# EAGLE schematic Board (EAGLE 9.5.1)
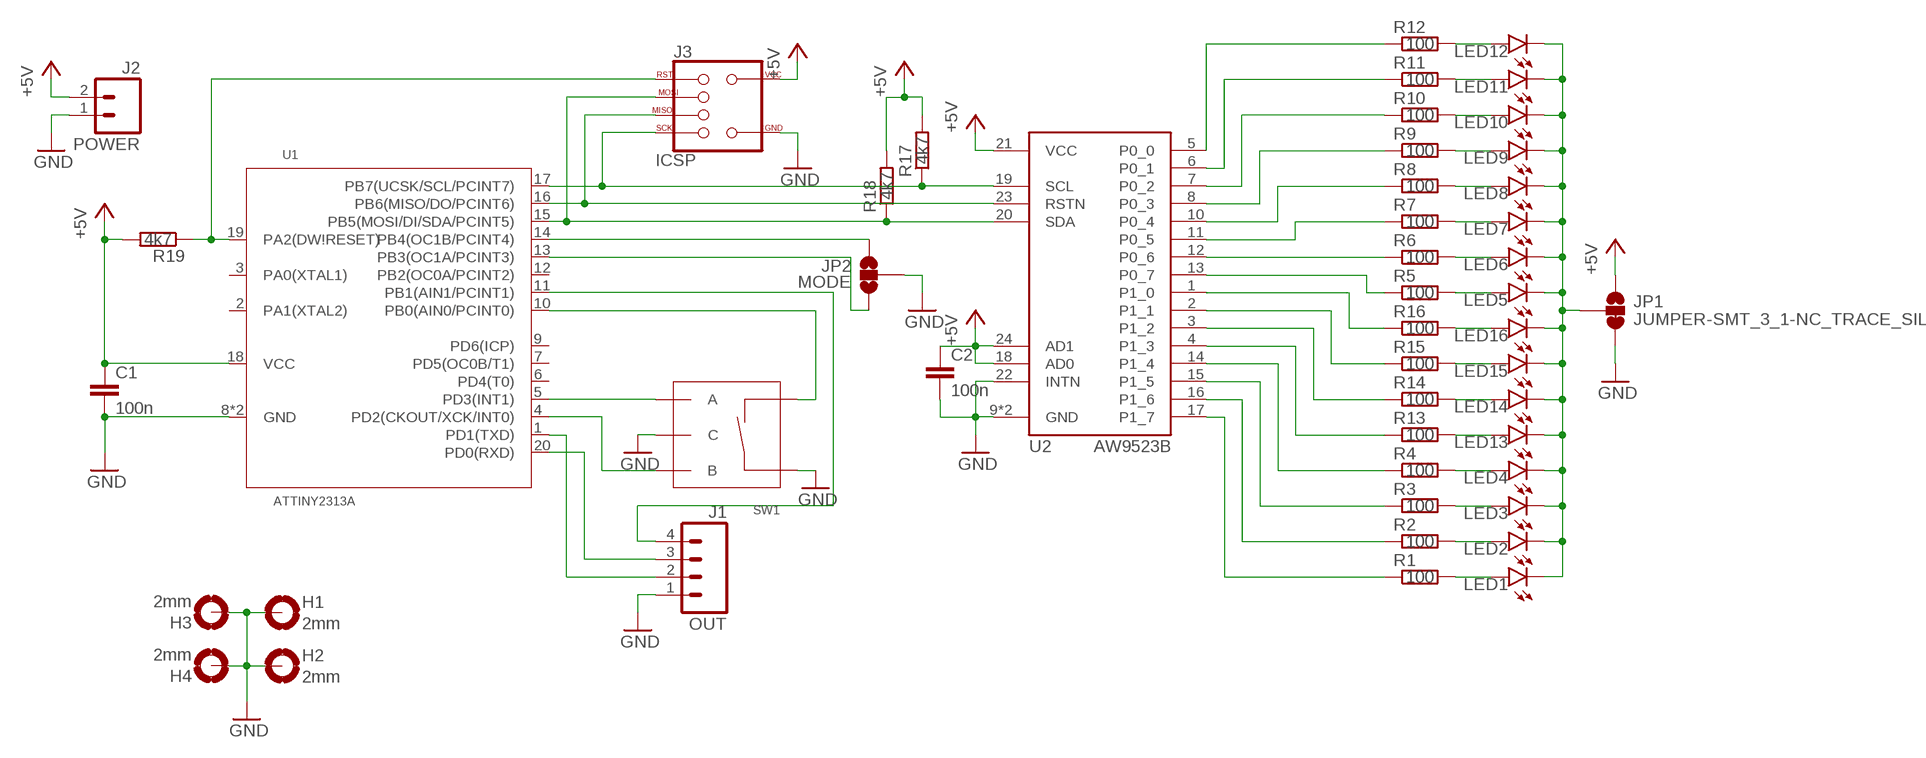
[diagram p0: schematic, sheet 1]

## Parts
C1  100n  C-EUC0402  [C0402]
C2  100n  C-EUC0402  [C0402]
H1  2mm  MOUNT-PAD2MM  [2,0-PAD]
H2  2mm  MOUNT-PAD2MM  [2,0-PAD]
H3  2mm  MOUNT-PAD2MM  [2,0-PAD]
H4  2mm  MOUNT-PAD2MM  [2,0-PAD]
J1  OUT  JST-XH4  [JST-4-PTH-VERT]
J2  POWER  JST-XH2  [JST-2-PTH-VERT]
J3  ICSP  MINI-ISP-LABELS  [MINI-ISP-LABELS]
JP1  JUMPER-SMT_3_1-NC_TRACE_SILK  [SMT-JUMPER_3_1-NC_TRACE_SILK]
JP2  MODE  JUMPER-SMT_3_NO_SILK  [SMT-JUMPER_3_NO_SILK]
LED1  LED-BLUE0603  [0603-BLUE]
LED2  LED-BLUE0603  [0603-BLUE]
LED3  LED-BLUE0603  [0603-BLUE]
LED4  LED-BLUE0603  [0603-BLUE]
LED5  LED-BLUE0603  [0603-BLUE]
LED6  LED-BLUE0603  [0603-BLUE]
LED7  LED-BLUE0603  [0603-BLUE]
LED8  LED-BLUE0603  [0603-BLUE]
LED9  LED-BLUE0603  [0603-BLUE]
LED10  LED-BLUE0603  [0603-BLUE]
LED11  LED-BLUE0603  [0603-BLUE]
LED12  LED-BLUE0603  [0603-BLUE]
LED13  LED-BLUE0603  [0603-BLUE]
LED14  LED-BLUE0603  [0603-BLUE]
LED15  LED-BLUE0603  [0603-BLUE]
LED16  LED-BLUE0603  [0603-BLUE]
R1  100  R-EU_R0402  [R0402]
R2  100  R-EU_R0402  [R0402]
R3  100  R-EU_R0402  [R0402]
R4  100  R-EU_R0402  [R0402]
R5  100  R-EU_R0402  [R0402]
R6  100  R-EU_R0402  [R0402]
R7  100  R-EU_R0402  [R0402]
R8  100  R-EU_R0402  [R0402]
R9  100  R-EU_R0402  [R0402]
R10  100  R-EU_R0402  [R0402]
R11  100  R-EU_R0402  [R0402]
R12  100  R-EU_R0402  [R0402]
R13  100  R-EU_R0402  [R0402]
R14  100  R-EU_R0402  [R0402]
R15  100  R-EU_R0402  [R0402]
R16  100  R-EU_R0402  [R0402]
R17  4k7  R-EU_R0402  [R0402]
R18  4k7  R-EU_R0402  [R0402]
R19  4k7  R-EU_R0402  [R0402]
SW1  ROTARTY_ENCODER  [ROTARY_ENC_PLAIN]
U1  ATTINY2313A  [QFN50P400X400X80-21T260N]
U2  AW9523B  [QFN50P400X400X80-25T270N]

## Nets
+5V: C1.1 C2.1 J2.2 J3.VDD JP1.1 R17.2 R18.2 R19.2 U1.18(VCC) U2.18(AD0) U2.21(VCC) U2.24(AD1)
GND: C1.2 C2.2 H1.B2,0(MOUNT) H2.B2,0(MOUNT) H3.B2,0(MOUNT) H4.B2,0(MOUNT) J1.1 J2.1 J3.GND JP1.3 JP2.2 SW1.C SW1.SW+ U1.8(GND) U1.21(GND) U2.9(GND) U2.22(INTN) U2.25(GND)
N$1: J3.RESET R19.1 U1.19(PA2(DW\!RESET))
N$2: LED12.A R12.2
N$3: LED11.A R11.2
N$4: LED10.A R10.2
N$5: LED9.A R9.2
N$6: LED8.A R8.2
N$7: LED7.A R7.2
N$8: LED6.A R6.2
N$9: LED5.A R5.2
N$10: LED16.A R16.2
N$11: LED15.A R15.2
N$12: LED14.A R14.2
N$13: LED13.A R13.2
N$14: LED4.A R4.2
N$15: LED3.A R3.2
N$16: LED2.A R2.2
N$17: LED1.A R1.2
N$18: J3.SCK R17.1 U1.17(PB7(UCSK/SCL/PCINT7)) U2.19(SCL)
N$19: J3.MISO U1.16(PB6(MISO/DO/PCINT6)) U2.23(RSTN)
N$20: J1.3 U1.20(PD0(RXD))
N$21: R12.1 U2.5(P0_0)
N$22: R11.1 U2.6(P0_1)
N$23: R10.1 U2.7(P0_2)
N$24: R9.1 U2.8(P0_3)
N$25: R8.1 U2.10(P0_4)
N$26: R7.1 U2.11(P0_5)
N$27: R6.1 U2.12(P0_6)
N$28: R5.1 U2.13(P0_7)
N$29: R16.1 U2.1(P1_0)
N$30: R15.1 U2.2(P1_1)
N$31: R14.1 U2.3(P1_2)
N$32: R13.1 U2.4(P1_3)
N$33: R4.1 U2.14(P1_4)
N$34: R3.1 U2.15(P1_5)
N$35: R2.1 U2.16(P1_6)
N$36: R1.1 U2.17(P1_7)
N$37: SW1.A U1.5(PD3(INT1))
N$38: SW1.SW- U1.10(PB0(AIN0/PCINT0))
N$39: J1.2 U1.1(PD1(TXD))
N$40: SW1.B U1.4(PD2(CKOUT/XCK/INT0))
N$41: J3.MOSI R18.1 U1.15(PB5(MOSI/DI/SDA/PCINT5)) U2.20(SDA)
N$42: J1.4 U1.11(PB1(AIN1/PCINT1))
N$43: JP2.3 U1.13(PB3(OC1A/PCINT3))
N$44: JP2.1 U1.14(PB4(OC1B/PCINT4))
N$45: JP1.2 LED1.C LED2.C LED3.C LED4.C LED5.C LED6.C LED7.C LED8.C LED9.C LED10.C LED11.C LED12.C LED13.C LED14.C LED15.C LED16.C
Unconnected: U1.2(PA1(XTAL2)) U1.3(PA0(XTAL1)) U1.6(PD4(T0)) U1.7(PD5(OC0B/T1)) U1.9(PD6(ICP)) U1.12(PB2(OC0A/PCINT2))

## Library data of the parts
C1 C2 = rcl:C-EU: CAPACITOR, European symbol; LCSC: C1525; SPICEPREFIX: C
H1-H4 = Parts:MOUNT-PAD
J1 = Class D Amp:JST-XH4
J2 = Class D Amp:JST-XH2
J3 = MiniISP:MINI-ISP
JP1 = SparkFun-Jumpers:JUMPER-SMT_3_1-NC_TRACE: Normally closed trace jumper (1 of 2 connections) This jumper has a trace between two pads so it's normally closed (NC). The other connection is normally open (NO). Use a razor knife to open the connection. For best results follow the IPC guidelines for cutting traces: Cutout at least 0.063 mm (0.005 in). Remove all loose material to clean up the cut area. Seal the cut with an approved epoxy. Reapply solder to reclose the connection, or to close the NO connection.
JP2 = SparkFun-Jumpers:JUMPER-SMT_3_NO: Normally open jumper This jumper has three pads in close proximity to each other. Apply solder to close the connection(s).
LED1-LED16 = BeagleBone_Blue_R3:LED-BLUE; LCSC: C2290
R1-R16 = rcl:R-EU_: RESISTOR, European symbol; LCSC: C25076; SPICEPREFIX: R
R17-R19 = rcl:R-EU_: RESISTOR, European symbol; LCSC: C25900; SPICEPREFIX: R
SW1 = SparkFun-Electromechanical:ROTARTY_ENCODER: Simple no LED rotary encoder Example: COM-09117
U1 = Parts:ATTINY2313; LCSC: C185530
U2 = Parts:AW9523B; LCSC: C148077